# EasyEDA schematic Mini_Keyboard_EasyEDA.json
TITLE: Sheet_1; REV: 1.0; Date: 2023-11-28; Sheet: 1/1; Drawn By: Adam Kirby; Company: Your Company
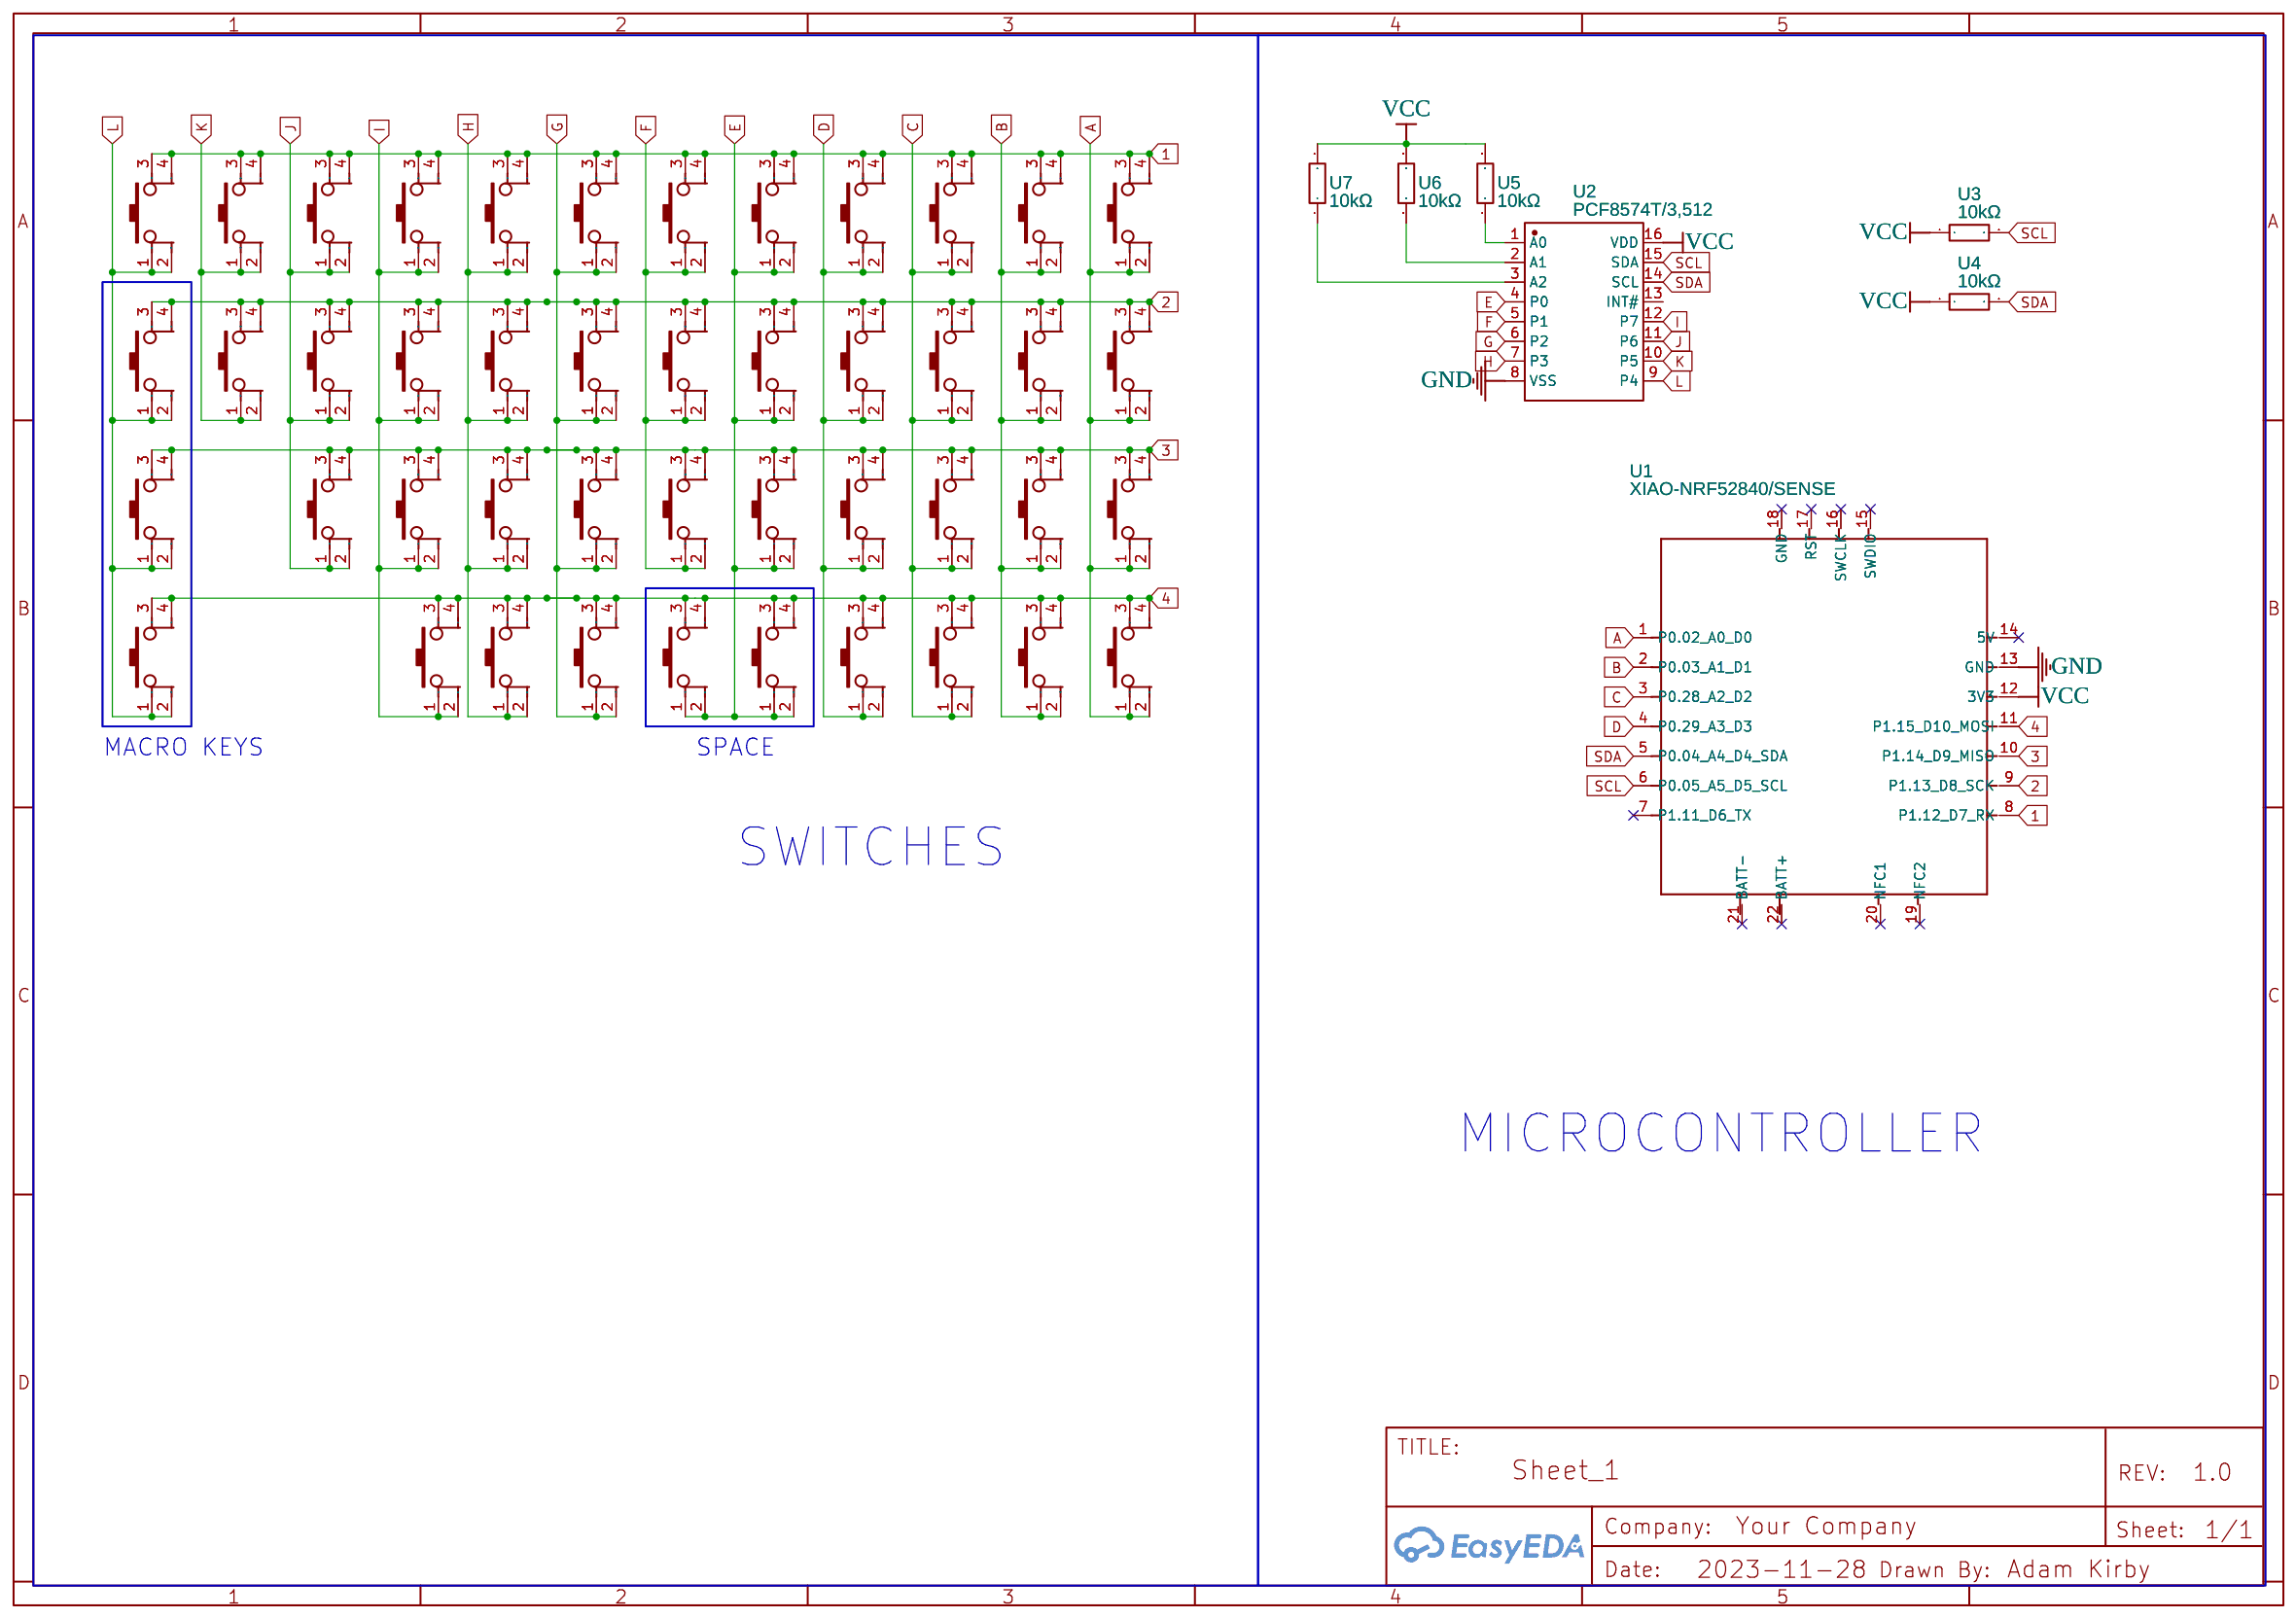
[diagram p0: schematic sheet]

## Parts
ESC  Switch-SMD-6x6x11  [SW-SMD_4P-L6.0-W6.0-P4.50-LS8.5]
MAC1  Switch-SMD-6x6x11  [SW-SMD_4P-L6.0-W6.0-P4.50-LS8.5]
MAC2  Switch-SMD-6x6x11  [SW-SMD_4P-L6.0-W6.0-P4.50-LS8.5]
MAC3  Switch-SMD-6x6x11  [SW-SMD_4P-L6.0-W6.0-P4.50-LS8.5]
SW1  Switch-SMD-6x6x11  [SW-SMD_4P-L6.0-W6.0-P4.50-LS8.5]
SW2  Switch-SMD-6x6x11  [SW-SMD_4P-L6.0-W6.0-P4.50-LS8.5]
SW3  Switch-SMD-6x6x11  [SW-SMD_4P-L6.0-W6.0-P4.50-LS8.5]
SW4  Switch-SMD-6x6x11  [SW-SMD_4P-L6.0-W6.0-P4.50-LS8.5]
SW5  Switch-SMD-6x6x11  [SW-SMD_4P-L6.0-W6.0-P4.50-LS8.5]
SW6  Switch-SMD-6x6x11  [SW-SMD_4P-L6.0-W6.0-P4.50-LS8.5]
SW7  Switch-SMD-6x6x11  [SW-SMD_4P-L6.0-W6.0-P4.50-LS8.5]
SW8  Switch-SMD-6x6x11  [SW-SMD_4P-L6.0-W6.0-P4.50-LS8.5]
SW9  Switch-SMD-6x6x11  [SW-SMD_4P-L6.0-W6.0-P4.50-LS8.5]
SW10  Switch-SMD-6x6x11  [SW-SMD_4P-L6.0-W6.0-P4.50-LS8.5]
SW11  Switch-SMD-6x6x11  [SW-SMD_4P-L6.0-W6.0-P4.50-LS8.5]
SW12  Switch-SMD-6x6x11  [SW-SMD_4P-L6.0-W6.0-P4.50-LS8.5]
SW13  Switch-SMD-6x6x11  [SW-SMD_4P-L6.0-W6.0-P4.50-LS8.5]
SW14  Switch-SMD-6x6x11  [SW-SMD_4P-L6.0-W6.0-P4.50-LS8.5]
SW15  Switch-SMD-6x6x11  [SW-SMD_4P-L6.0-W6.0-P4.50-LS8.5]
SW16  Switch-SMD-6x6x11  [SW-SMD_4P-L6.0-W6.0-P4.50-LS8.5]
SW17  Switch-SMD-6x6x11  [SW-SMD_4P-L6.0-W6.0-P4.50-LS8.5]
SW18  Switch-SMD-6x6x11  [SW-SMD_4P-L6.0-W6.0-P4.50-LS8.5]
SW19  Switch-SMD-6x6x11  [SW-SMD_4P-L6.0-W6.0-P4.50-LS8.5]
SW20  Switch-SMD-6x6x11  [SW-SMD_4P-L6.0-W6.0-P4.50-LS8.5]
SW21  Switch-SMD-6x6x11  [SW-SMD_4P-L6.0-W6.0-P4.50-LS8.5]
SW22  Switch-SMD-6x6x11  [SW-SMD_4P-L6.0-W6.0-P4.50-LS8.5]
SW23  Switch-SMD-6x6x11  [SW-SMD_4P-L6.0-W6.0-P4.50-LS8.5]
SW24  Switch-SMD-6x6x11  [SW-SMD_4P-L6.0-W6.0-P4.50-LS8.5]
SW25  Switch-SMD-6x6x11  [SW-SMD_4P-L6.0-W6.0-P4.50-LS8.5]
SW27  Switch-SMD-6x6x11  [SW-SMD_4P-L6.0-W6.0-P4.50-LS8.5]
SW28  Switch-SMD-6x6x11  [SW-SMD_4P-L6.0-W6.0-P4.50-LS8.5]
SW29  Switch-SMD-6x6x11  [SW-SMD_4P-L6.0-W6.0-P4.50-LS8.5]
SW30  Switch-SMD-6x6x11  [SW-SMD_4P-L6.0-W6.0-P4.50-LS8.5]
SW31  Switch-SMD-6x6x11  [SW-SMD_4P-L6.0-W6.0-P4.50-LS8.5]
SW32  Switch-SMD-6x6x11  [SW-SMD_4P-L6.0-W6.0-P4.50-LS8.5]
SW33  Switch-SMD-6x6x11  [SW-SMD_4P-L6.0-W6.0-P4.50-LS8.5]
SW34  Switch-SMD-6x6x11  [SW-SMD_4P-L6.0-W6.0-P4.50-LS8.5]
SW35  Switch-SMD-6x6x11  [SW-SMD_4P-L6.0-W6.0-P4.50-LS8.5]
SW43  Switch-SMD-6x6x11  [SW-SMD_4P-L6.0-W6.0-P4.50-LS8.5]
SW44  Switch-SMD-6x6x11  [SW-SMD_4P-L6.0-W6.0-P4.50-LS8.5]
SW45  Switch-SMD-6x6x11  [SW-SMD_4P-L6.0-W6.0-P4.50-LS8.5]
SW46  Switch-SMD-6x6x11  [SW-SMD_4P-L6.0-W6.0-P4.50-LS8.5]
SW47  Switch-SMD-6x6x11  [SW-SMD_4P-L6.0-W6.0-P4.50-LS8.5]
SW48  Switch-SMD-6x6x11  [SW-SMD_4P-L6.0-W6.0-P4.50-LS8.5]
SW49  Switch-SMD-6x6x11  [SW-SMD_4P-L6.0-W6.0-P4.50-LS8.5]
U1  XIAO-NRF52840/SENSE  [XIAO-NRF52840/SENSE-MODULE14P-2.54-21X17.8MM]
U2  PCF8574T/3,512  [SO-16_L10.3-W7.5-P1.27-LS10.6-BL]
U3  10kΩ  [R0805]
U4  10kΩ  [R0805]
U5  10kΩ  [R0805]
U6  10kΩ  [R0805]
U7  10kΩ  [R0805]

## Library data of the parts
ESC MAC1-MAC3 SW1-SW25 SW27-SW35 SW43-SW49 = Switch-SMD-6x6x11: Supplier Part: C91998; Supplier: LCSC; Manufacturer: BBJ; Manufacturer Part: Switch6*6*11; JLCPCB Part Class: Extended Part; link: https://lcsc.com/eda_search?q=C91998&%26type=1&ref=editor
U1 = XIAO-NRF52840/SENSE: Contributor: jacobstamand
U2 = PCF8574T/3,512: Contributor: LCSC; Supplier: LCSC; Supplier Part: C1522621; Manufacturer: NXP(恩智浦); JLCPCB Part Class: Extended Part; link: https://lcsc.com/eda_search?q=C1522621&%26type=1&ref=editor
U3-U7 = RNCF0805TKW10K0: Contributor: lcsc; Supplier: LCSC; Supplier Part: C4161841; Manufacturer: SEI(Stackpole Electronics Inc.); link: https://lcsc.com/eda_search?q=C4161841&%26type=1&ref=editor

## Nets
GND: U1.13(GND) U2.8(VSS)
VCC: U1.12(3V3) U2.16(VDD) U3.1 U4.1 U5.2 U6.2 U7.2
1: SW1.3 SW1.4 SW2.3 SW2.4 SW3.3 SW3.4 SW4.3 SW4.4 SW5.3 SW5.4 SW6.3 SW6.4 SW7.3 SW7.4 SW8.3 SW8.4 SW9.3 SW9.4 SW10.3 SW10.4 SW11.3 SW11.4 SW12.3 SW12.4 U1.8(P1.12_D7_RX)
2: MAC1.3 MAC1.4 SW13.3 SW13.4 SW14.3 SW14.4 SW15.3 SW15.4 SW16.3 SW16.4 SW17.3 SW17.4 SW18.3 SW18.4 SW19.3 SW19.4 SW20.3 SW20.4 SW21.3 SW21.4 SW22.3 SW22.4 SW23.3 SW23.4 U1.9(P1.13_D8_SCK)
3: ESC.3 ESC.4 MAC2.3 MAC2.4 SW24.3 SW24.4 SW25.3 SW25.4 SW43.3 SW43.4 SW44.3 SW44.4 SW45.3 SW45.4 SW46.3 SW46.4 SW47.3 SW47.4 SW48.3 SW48.4 SW49.3 SW49.4 U1.10(P1.14_D9_MISO)
4: MAC3.3 MAC3.4 SW27.3 SW27.4 SW28.3 SW28.4 SW29.3 SW29.4 SW30.3 SW30.4 SW31.3 SW31.4 SW32.3 SW32.4 SW33.3 SW33.4 SW34.3 SW34.4 SW35.3 SW35.4 U1.11(P1.15_D10_MOSI)
A: ESC.1 ESC.2 SW10.1 SW10.2 SW13.1 SW13.2 SW27.1 SW27.2 U1.1(P0.02_A0_D0)
B: SW11.1 SW11.2 SW15.1 SW15.2 SW24.1 SW24.2 SW29.1 SW29.2 U1.2(P0.03_A1_D1)
C: SW12.1 SW12.2 SW14.1 SW14.2 SW25.1 SW25.2 SW28.1 SW28.2 U1.3(P0.28_A2_D2)
D: SW7.1 SW7.2 SW18.1 SW18.2 SW32.1 SW32.2 SW45.1 SW45.2 U1.4(P0.29_A3_D3)
E: SW8.1 SW8.2 SW17.1 SW17.2 SW30.1 SW30.2 SW31.1 SW31.2 SW44.1 SW44.2 U2.4(P0)
F: SW9.1 SW9.2 SW16.1 SW16.2 SW43.1 SW43.2 U2.5(P1)
G: SW4.1 SW4.2 SW21.1 SW21.2 SW35.1 SW35.2 SW48.1 SW48.2 U2.6(P2)
H: SW5.1 SW5.2 SW20.1 SW20.2 SW34.1 SW34.2 SW47.1 SW47.2 U2.7(P3)
I: SW6.1 SW6.2 SW19.1 SW19.2 SW33.1 SW33.2 SW46.1 SW46.2 U2.12(P7)
J: SW3.1 SW3.2 SW22.1 SW22.2 SW49.1 SW49.2 U2.11(P6)
K: SW2.1 SW2.2 SW23.1 SW23.2 U2.10(P5)
L: MAC1.1 MAC1.2 MAC2.1 MAC2.2 MAC3.1 MAC3.2 SW1.1 SW1.2 U2.9(P4)
SCL: U1.6(P0.05_A5_D5_SCL) U2.15(SDA) U3.2
SDA: U1.5(P0.04_A4_D4_SDA) U2.14(SCL) U4.2
Net-(U2-1): U2.1(A0) U5.1
Net-(U2-2): U2.2(A1) U6.1
Net-(U2-3): U2.3(A2) U7.1

Not connected (* = marked no-connect by the designer): U1 7(P1.11_D6_TX)* 14(5V)* 15(SWDIO)* 16(SWCLK)* 17(RST)* 18(GND)* 19(NFC2)* 20(NFC1)* 21(BATT-)* 22(BATT+)*; U2 13(INT#)

## Notes on the sheet
- MACRO KEYS
- SPACE
- SWITCHES
- MICROCONTROLLER
